# EAGLE schematic control_board (EAGLE 6.4)
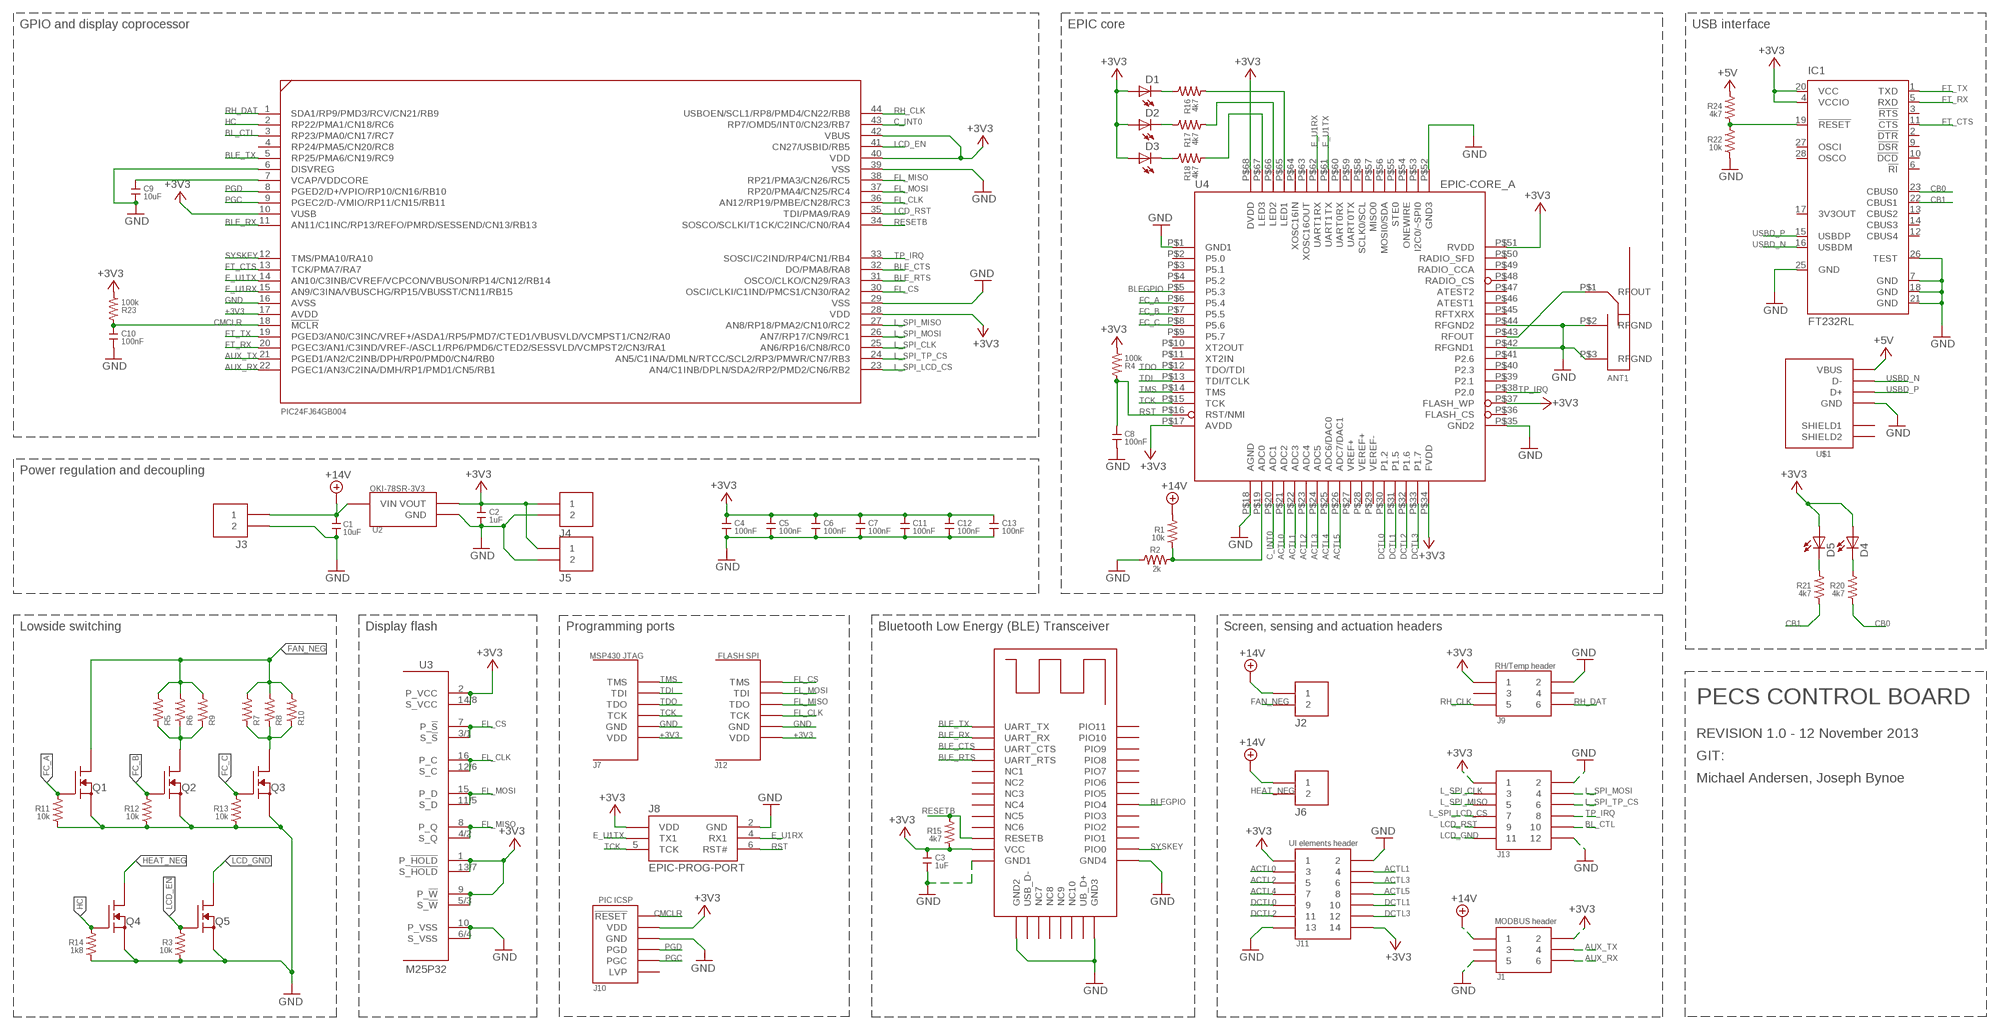
[diagram p0: schematic, sheet 1]

## Parts
ANT1  PIFA-2.4GHZ  [PIFA-2.4GHZ]
BLE1  HM10_BLE  [HM10]
C1  10uF  0805_CAPACITOR  [0805]
C2  1uF  0805_CAPACITOR  [0805]
C3  1uF  0805_CAPACITOR  [0805]
C4  100nF  0805_CAPACITOR  [0805]
C5  100nF  0805_CAPACITOR  [0805]
C6  100nF  0805_CAPACITOR  [0805]
C7  100nF  0805_CAPACITOR  [0805]
C8  100nF  0805_CAPACITOR  [0805]
C9  10uF  0805_CAPACITOR  [0805]
C10  100nF  0805_CAPACITOR  [0805]
C11  100nF  0805_CAPACITOR  [0805]
C12  100nF  0805_CAPACITOR  [0805]
C13  100nF  0805_CAPACITOR  [0805]
D1  LED1206  [LED-1206]
D2  LED1206  [LED-1206]
D3  LED1206  [LED-1206]
D4  LED1206  [LED-1206]
D5  LED1206  [LED-1206]
IC1  FT232RL  [SSOP28]
J1  HD.1-6  [HD.1-6]
J2  H.1-2  [H.1-2]
J3  H.1-2  [H.1-2]
J4  H.1-2  [H.1-2]
J5  H.1-2  [H.1-2]
J6  H.1-2  [H.1-2]
J7  JTAG  [JTAG]
J8  EPIC-PROG-PORT  [HEADER2X3X2MM]
J9  HD.1-6  [HD.1-6]
J10  ICSP_HDR  [H.1-6]
J11  HD.1-14  [HD.1-16]
J12  JTAG  [JTAG]
J13  HD.1-12  [HD.1-12]
Q1  NFET_DPAK  [DPAK]
Q2  NFET_DPAK  [DPAK]
Q3  NFET_DPAK  [DPAK]
Q4  NFET_DPAK  [DPAK]
Q5  NFET_DPAK  [DPAK]
R1  10k  0805_RESISTOR  [0805]
R2  2k  0805_RESISTOR  [0805]
R3  10k  0805_RESISTOR  [0805]
R4  100k  0805_RESISTOR  [0805]
R5  1206_RESISTOR  [1206]
R6  1206_RESISTOR  [1206]
R7  1206_RESISTOR  [1206]
R8  1206_RESISTOR  [1206]
R9  1206_RESISTOR  [1206]
R10  1206_RESISTOR  [1206]
R11  10k  0805_RESISTOR  [0805]
R12  10k  0805_RESISTOR  [0805]
R13  10k  0805_RESISTOR  [0805]
R14  1k8  0805_RESISTOR  [0805]
R15  4k7  0805_RESISTOR  [0805]
R16  4k7  0805_RESISTOR  [0805]
R17  4k7  0805_RESISTOR  [0805]
R18  4k7  0805_RESISTOR  [0805]
R20  4k7  0805_RESISTOR  [0805]
R21  4k7  0805_RESISTOR  [0805]
R22  10k  0805_RESISTOR  [0805]
R23  100k  0805_RESISTOR  [0805]
R24  4k7  0805_RESISTOR  [0805]
U1  PIC24FJ32GB004  [TQFP44]
U2  OKI-78SR_3V3_SMPS  [SMPS_MODULE]
U3  NUMONYX_FLASH  [NUMONYX_FLASH]
U4  EPIC-CORE_A  [EPIC-LCC68]
U$1  USB_B  [USB_MOLEX_7041]

## Nets
+3V3: BLE1.P$12(VCC) C2.2 C3.2 C4.2 C5.2 C6.2 C7.2 C11.2 C12.2 C13.2 D1.A D2.A D3.A D4.A D5.A IC1.4(VCCIO) IC1.20(VCC) J1.P2 J4.P1 J5.P1 J7.VDD J8.1(VDD) J9.P1 J10.P2(VDD) J11.P1 J11.P14 J12.VDD J13.P1 R4.1 R15.1 R23.1 U1.10(VUSB) U1.17(AVDD) U1.28(VDD) U1.40(VDD) U1.42(VBUS) U2.VOUT U3.1(P_!HOLD!) U3.2(P_VCC) U3.5/3(S_!W!) U3.9(P_!W!) U3.13/7(S_!HOLD!) U3.14/8(S_VCC) U4.P$17(AVDD) U4.P$34(FVDD) U4.P$37(FLASH_WP) U4.P$51(RVDD) U4.P$68(DVDD)
+5V: R24.2 U$1.1_VBUS(VBUS)
+14V: C1.2 J1.P1 J2.P1 J3.P1 J6.P1 R1.2 U2.VIN
ACTL0: J11.P3 U4.P$21(ADC2)
ACTL1: J11.P4 U4.P$22(ADC3)
ACTL2: J11.P5 U4.P$23(ADC4)
ACTL3: J11.P6 U4.P$24(ADC5)
ACTL4: J11.P7 U4.P$25(ADC6/DAC0)
ACTL5: J11.P8 U4.P$26(ADC7/DAC1)
AUX_RX: J1.P6 U1.22(PGEC1/AN3/C2INA/DMH/RP1/PMD1/CN5/RB1)
AUX_TX: J1.P4 U1.21(PGED1/AN2/C2INB/DPH/RP0/PMD0/CN4/RB0)
BL_CTL: J13.P10 U1.3(RP23/PMA0/CN17/RC7)
BLE_CTS: BLE1.P$3(UART_CTS) U1.32(DO/PMA8/RA8)
BLE_RTS: BLE1.P$4(UART_RTS) U1.31(OSCO/CLKO/CN29/RA3)
BLE_RX: BLE1.P$2(UART_RX) U1.11(AN11/C1INC/RP13/REFO/PMRD/SESSEND/CN13/RB13)
BLE_TX: BLE1.P$1(UART_TX) U1.5(RP25/PMA6/CN19/RC9)
BLEGPIO: BLE1.P$27(PIO4) U4.P$5(P5.3)
C_INT0: U1.43(RP7/OMD5/INT0/CN23/RB7) U4.P$20(ADC1)
CB0: IC1.23(CBUS0) R20.1
CB1: IC1.22(CBUS1) R21.1
CMCLR: C10.2 J10.P1(!RESET!) R23.2 U1.18(!MCLR!)
DCTL0: J11.P9 U4.P$30(P1.2)
DCTL1: J11.P10 U4.P$31(P1.5)
DCTL2: J11.P11 U4.P$32(P1.6)
DCTL3: J11.P12 U4.P$33(P1.7)
E_U1RX: J8.4(RX1) U1.15(AN9/C3INA/VBUSCHG/RP15/VBUSST/CN11/RB15) U4.P$62(UART1RX)
E_U1TX: J8.3(TX1) U1.14(AN10/C3INB/CVREF/VCPCON/VBUSON/RP14/CN12/RB14) U4.P$61(UART1TX)
FAN_NEG: J2.P2 Q1.TAG(D) R5.2 R6.2 R7.2 R8.2 R9.2 R10.2
FC_A: Q1.P1(G) R11.2 U4.P$6(P5.4)
FC_B: Q2.P1(G) R12.2 U4.P$7(P5.5)
FC_C: Q3.P1(G) R13.2 U4.P$8(P5.6)
FL_CLK: J12.TCK U1.36(AN12/RP19/PMBE/CN28/RC3) U3.12/6(S_C) U3.16(P_C)
FL_CS: J12.TMS U1.30(OSCI/CLKI/C1IND/PMCS1/CN30/RA2) U3.3/1(S_!S!) U3.7(P_!S!)
FL_MISO: J12.TDO U1.38(RP21/PMA3/CN26/RC5) U3.4/2(S_Q) U3.8(P_Q)
FL_MOSI: J12.TDI U1.37(RP20/PMA4/CN25/RC4) U3.11/5(S_D) U3.15(P_D)
FT_CTS: IC1.11(!CTS) U1.13(TCK/PMA7/RA7)
FT_RX: IC1.5(RXD) U1.20(PGEC3/AN1/C3IND/VREF-/ASCL1/RP6/PMD6/CTED2/SESSVLD/VCMPST2/CN3/RA1)
FT_TX: IC1.1(TXD) U1.19(PGED3/AN0/C3INC/VREF+/ASDA1/RP5/PMD7/CTED1/VBUSVLD/VCMPST1/CN2/RA0)
GND: ANT1.P$2(RFGND) ANT1.P$3(RFGND) BLE1.P$13(GND1) BLE1.P$14(GND2) BLE1.P$21(GND3) BLE1.P$22(GND4) C1.1 C2.1 C3.1 C4.1 C5.1 C6.1 C7.1 C8.1 C9.1 C10.1 C11.1 C12.1 C13.1 IC1.7(GND) IC1.18(GND) IC1.21(GND) IC1.25(GND) IC1.26(TEST) J1.P5 J3.P2 J4.P2 J5.P2 J7.GND J8.2(GND) J9.P2 J10.P3(GND) J11.P2 J11.P13 J12.GND J13.P2 J13.P12 Q1.P3(S) Q2.P3(S) Q3.P3(S) Q4.P3(S) Q5.P3(S) R2.1 R3.1 R11.1 R12.1 R13.1 R14.1 R22.1 U1.6(DISVREG) U1.16(AVSS) U1.29(VSS) U1.39(VSS) U2.GND U3.6/4(S_VSS) U3.10(P_VSS) U4.P$1(GND1) U4.P$18(AGND) U4.P$35(GND2) U4.P$42(RFGND1) U4.P$44(RFGND2) U4.P$52(GND3) U$1.4_GND(GND)
HC: Q4.P1(G) R14.2 U1.2(RP22/PMA1/CN18/RC6)
HEAT_NEG: J6.P2 Q4.TAG(D)
L_SPI_CLK: J13.P3 U1.25(AN6/RP16/CN8/RC0)
L_SPI_LCD_CS: J13.P7 U1.23(AN4/C1INB/DPLN/SDA2/RP2/PMD2/CN6/RB2)
L_SPI_MISO: J13.P5 U1.27(AN8/RP18/PMA2/CN10/RC2)
L_SPI_MOSI: J13.P4 U1.26(AN7/RP17/CN9/RC1)
L_SPI_TP_CS: J13.P6 U1.24(AN5/C1INA/DMLN/RTCC/SCL2/RP3/PMWR/CN7/RB3)
LCD_EN: Q5.P1(G) R3.2 U1.41(CN27/USBID/RB5)
LCD_GND: J13.P11 Q5.TAG(D)
LCD_RST: J13.P9 U1.35(TDI/PMA9/RA9)
N$1: C9.2 U1.7(VCAP/VDDCORE)
N$3: ANT1.P$1(RFOUT) U4.P$43(RFOUT)
N$6: Q2.TAG(D) R5.1 R6.1 R9.1
N$7: Q3.TAG(D) R7.1 R8.1 R10.1
N$9: D4.C R20.2
N$10: D1.C R16.2
N$11: D2.C R17.2
N$12: D3.C R18.2
N$13: R16.1 U4.P$65(LED1)
N$14: D5.C R21.2
N$15: R17.1 U4.P$66(LED2)
N$16: R18.1 U4.P$67(LED3)
N$19: IC1.19(!RESET) R22.2 R24.1
N$23: R1.1 R2.2 U4.P$19(ADC0)
PGC: J10.P5(PGC) U1.9(PGEC2/D-/VMIO/RP11/CN15/RB11)
PGD: J10.P4(PGD) U1.8(PGED2/D+/VPIO/RP10/CN16/RB10)
RESETB: BLE1.P$11(RESETB) R15.2 U1.34(SOSCO/SCLKI/T1CK/C2INC/CN0/RA4)
RH_CLK: J9.P5 U1.44(USBOEN/SCL1/RP8/PMD4/CN22/RB8)
RH_DAT: J9.P6 U1.1(SDA1/RP9/PMD3/RCV/CN21/RB9)
RST: C8.2 J8.6(RST#) R4.2 U4.P$16(RST/NMI)
SYSKEY: BLE1.P$23(PIO0) U1.12(TMS/PMA10/RA10)
TCK: J7.TCK J8.5(TCK) U4.P$15(TCK)
TDI: J7.TDI U4.P$13(TDI/TCLK)
TDO: J7.TDO U4.P$12(TDO/TDI)
TMS: J7.TMS U4.P$14(TMS)
TP_IRQ: J13.P8 U1.33(SOSCI/C2IND/RP4/CN1/RB4) U4.P$38(P2.0)
USBD_N: IC1.16(USBDM) U$1.2_D-(D-)
USBD_P: IC1.15(USBDP) U$1.3_D+(D+)
Unconnected: BLE1.P$5(NC1) BLE1.P$6(NC2) BLE1.P$7(NC3) BLE1.P$8(NC4) BLE1.P$9(NC5) BLE1.P$10(NC6) BLE1.P$15(USB_D-) BLE1.P$16(NC7) BLE1.P$17(NC8) BLE1.P$18(NC9) BLE1.P$19(NC10) BLE1.P$20(UB_D+) BLE1.P$24(PIO1) BLE1.P$25(PIO2) BLE1.P$26(PIO3) BLE1.P$28(PIO5) BLE1.P$29(PIO6) BLE1.P$30(PIO7) BLE1.P$31(PIO8) BLE1.P$32(PIO9) BLE1.P$33(PIO10) BLE1.P$34(PIO11) IC1.2(!DTR) IC1.3(!RTS) IC1.6(!RI) IC1.9(!DSR) IC1.10(!DCD) IC1.12(CBUS4) IC1.13(CBUS2) IC1.14(CBUS3) IC1.17(3V3OUT) IC1.27(OSCI) IC1.28(OSCO) J1.P3 J9.P3 J9.P4 J10.P6(LVP) U1.4(RP24/PMA5/CN20/RC8) U4.P$2(P5.0) U4.P$3(P5.1) U4.P$4(P5.2) U4.P$9(P5.7) U4.P$10(XT2OUT) U4.P$11(XT2IN) U4.P$27(VREF+) U4.P$28(VEREF+) U4.P$29(VEREF-) U4.P$36(FLASH_CS) U4.P$39(P2.1) U4.P$40(P2.3) U4.P$41(P2.6) U4.P$45(RFTXRX) U4.P$46(ATEST1) U4.P$47(ATEST2) U4.P$48(RADIO_CS) U4.P$49(RADIO_CCA) U4.P$50(RADIO_SFD) U4.P$53(I2C0/~SPI0) U4.P$54(ONEWIRE) U4.P$55(STE0) U4.P$56(MOSI0/SDA) U4.P$57(MISO0) U4.P$58(SCLK0/SCL) U4.P$59(UART0TX) U4.P$60(UART0RX) U4.P$63(XOSC16OUT) U4.P$64(XOSC16IN) U$1.SHIELD1 U$1.SHIELD2

## Notes on the sheet
- GPIO and display coprocessor | EPIC core | USB interface
- PIC24FJ64GB004
- Power regulation and decoupling
- Lowside switching | Display flash | Programming ports | Bluetooth Low Energy (BLE) Transceiver | Screen, sensing and actuation headers
- MSP430 JTAG | FLASH SPI
- RH/Temp header
- PECS CONTROL BOARD
- REVISION 1.0 - 12 November 2013
- GIT:
- Michael Andersen, Joseph Bynoe
- UI elements header
- PIC ICSP
- MODBUS header

## Library data of the parts
ANT1 = berkeley-epic:PIFA-2.4GHZ
BLE1 = pecs:HM10_BLE
C1-C13 = pecs:0805_CAPACITOR
D1-D5 = berkeley-epic:LED: LEDs Standard schematic elements and footprints for 5mm, 3mm, 1206, and 0603 sized LEDs. 5mm - Spark Fun Electronics SKU : COM-00529 (and others)
IC1 = ftdichip:FT232R: Source: http://www.ftdichip.com/Documents/DataSheets/DS_FT232R_v104.pdf; MPN: FT232RL; OC_FARNELL: 1146032; OC_NEWARK: 91K9918
J1 J9 = pecs:HD.1-6
J2-J6 = pecs:H.1-2
J7 J12 = pecs:JTAG
J8 = berkeley-epic:EPIC-PROG-PORT
J10 = pecs:ICSP_HDR
J11 = pecs:HD.1-14
J13 = pecs:HD.1-12
Q1-Q5 = pecs:NFET_DPAK
R1-R4 R11-R18 R20-R24 = pecs:0805_RESISTOR
R5-R10 = pecs:1206_RESISTOR
U1 = pecs:PIC24FJ32GB004
U2 = pecs:OKI-78SR_3V3_SMPS
U3 = pecs:NUMONYX_FLASH
U4 = berkeley-epic:EPIC-CORE_A
U$1 = pecs:USB_B